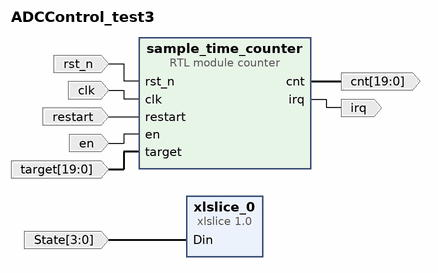
[diagram p0: block diagram of the top level]
# Vivado block design ADCControl_test3, xczu3eg-sbva484-1-i, Vivado 2020.2
create_bd_design ADCControl_test3

create_bd_port -dir I -type rst rst_n
create_bd_port -dir I -type clk clk
create_bd_port -dir O irq
create_bd_port -dir O -from 19 -to 0 cnt
create_bd_port -dir I restart
create_bd_port -dir I en
create_bd_port -dir I -from 19 -to 0 target
create_bd_port -dir I -from 3 -to 0 State

create_bd_cell -type ip -vlnv xilinx.com:ip:xlslice:1.0 xlslice_0
set_property -dict {CONFIG.DIN_WIDTH 4} [get_bd_cells xlslice_0]
create_bd_cell -type module -reference counter sample_time_counter
set_property -dict {CONFIG.auto_rst {"0"} CONFIG.n_bits 20} [get_bd_cells sample_time_counter]

# ---- connections ----

connect_bd_net -net rst_n_0_1 [get_bd_ports rst_n] [get_bd_pins sample_time_counter/rst_n]
connect_bd_net -net clk_0_1 [get_bd_ports clk] [get_bd_pins sample_time_counter/clk]
connect_bd_net [get_bd_pins sample_time_counter/irq] [get_bd_ports irq]
connect_bd_net [get_bd_pins sample_time_counter/cnt] [get_bd_ports cnt]
connect_bd_net -net restart_0_1 [get_bd_ports restart] [get_bd_pins sample_time_counter/restart]
connect_bd_net -net en_0_1 [get_bd_ports en] [get_bd_pins sample_time_counter/en]
connect_bd_net -net target_0_1 [get_bd_ports target] [get_bd_pins sample_time_counter/target]
connect_bd_net -net Din_0_1 [get_bd_ports State] [get_bd_pins xlslice_0/Din]

validate_bd_design
save_bd_design
